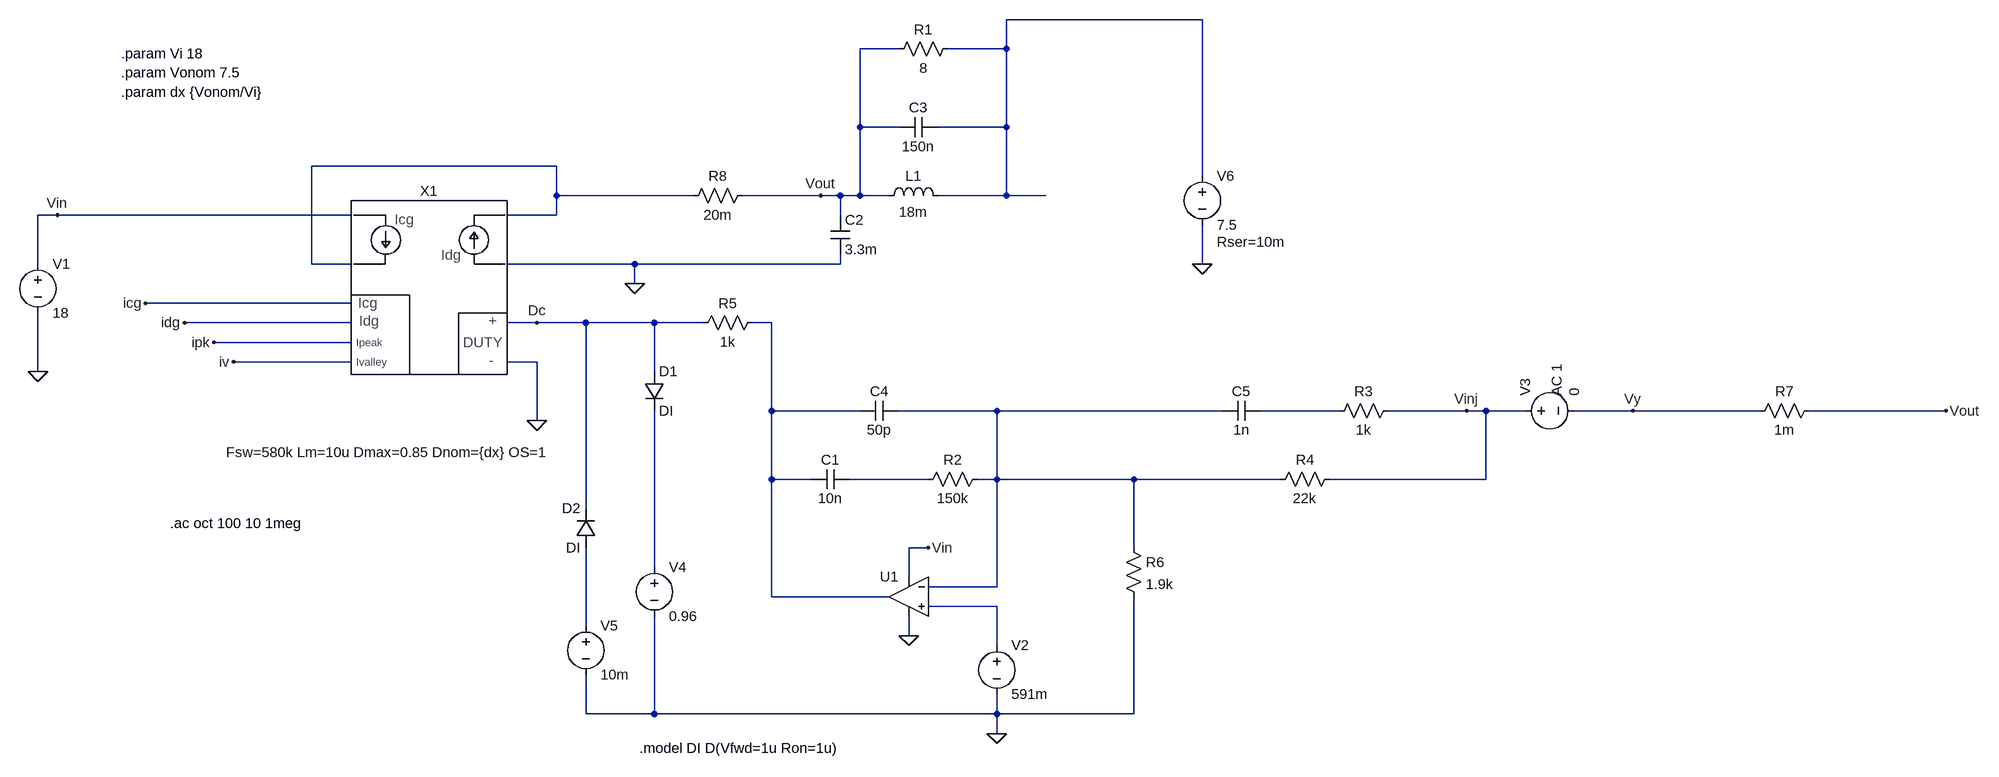
[diagram p0: schematic TPS40195_Reference_AC.asc]
TPS40195_Reference_AC.asc, the LTspice schematic file:
Version 4
SHEET 1 2744 952
WIRE 1456 -256 1136 -256
WIRE 960 -208 896 -208
WIRE 1136 -208 1136 -256
WIRE 1136 -208 1040 -208
WIRE 896 -80 896 -208
WIRE 960 -80 896 -80
WIRE 1136 -80 1136 -208
WIRE 1136 -80 1024 -80
WIRE 400 -16 0 -16
WIRE 1456 0 1456 -256
WIRE 400 32 400 -16
WIRE 624 32 400 32
WIRE 832 32 704 32
WIRE 864 32 832 32
WIRE 896 32 896 -80
WIRE 896 32 864 32
WIRE 944 32 896 32
WIRE 1136 32 1136 -80
WIRE 1136 32 1024 32
WIRE 1200 32 1136 32
WIRE -416 64 -448 64
WIRE 64 64 -416 64
WIRE 400 64 400 32
WIRE 400 64 320 64
WIRE 864 64 864 32
WIRE -448 144 -448 64
WIRE 0 144 0 -16
WIRE 64 144 0 144
WIRE 528 144 320 144
WIRE 864 144 864 128
WIRE 864 144 528 144
WIRE 1456 144 1456 80
WIRE 528 176 528 144
WIRE 64 208 -272 208
WIRE 64 240 -208 240
WIRE 368 240 320 240
WIRE 448 240 368 240
WIRE 560 240 448 240
WIRE 640 240 560 240
WIRE 752 240 720 240
WIRE 64 272 -160 272
WIRE 64 304 -128 304
WIRE 368 304 320 304
WIRE -448 320 -448 224
WIRE 560 320 560 240
WIRE 752 384 752 240
WIRE 896 384 752 384
WIRE 1120 384 960 384
WIRE 1488 384 1120 384
WIRE 1680 384 1552 384
WIRE 1888 384 1760 384
WIRE 1920 384 1888 384
WIRE 1984 384 1920 384
WIRE 2160 384 2064 384
WIRE 2368 384 2160 384
WIRE 2672 384 2448 384
WIRE 368 400 368 304
WIRE 752 496 752 384
WIRE 816 496 752 496
WIRE 1008 496 880 496
WIRE 1120 496 1120 384
WIRE 1120 496 1088 496
WIRE 1344 496 1120 496
WIRE 1584 496 1344 496
WIRE 1920 496 1920 384
WIRE 1920 496 1664 496
WIRE 448 544 448 240
WIRE 1008 608 976 608
WIRE 1344 608 1344 496
WIRE 560 640 560 384
WIRE 976 656 976 608
WIRE 1120 672 1120 496
WIRE 1120 672 1008 672
WIRE 752 688 752 496
WIRE 944 688 752 688
WIRE 1120 704 1008 704
WIRE 448 736 448 608
WIRE 976 752 976 720
WIRE 1120 768 1120 704
WIRE 448 880 448 816
WIRE 560 880 560 720
WIRE 560 880 448 880
WIRE 1120 880 1120 848
WIRE 1120 880 560 880
WIRE 1344 880 1344 688
WIRE 1344 880 1120 880
WIRE 1120 912 1120 880
FLAG 528 176 0
FLAG -448 320 0
FLAG 832 32 Vout
FLAG -416 64 Vin
FLAG 368 240 Dc
FLAG -272 208 icg
FLAG -208 240 idg
FLAG -160 272 ipk
FLAG -128 304 iv
FLAG 368 400 0
FLAG 976 752 0
FLAG 1008 608 Vin
FLAG 1120 912 0
FLAG 2672 384 Vout
FLAG 1888 384 Vinj
FLAG 1456 144 0
FLAG 2160 384 Vy
DATAFLAG -208 208 ""
DATAFLAG -112 240 ""
DATAFLAG -112 272 ""
DATAFLAG -32 304 ""
DATAFLAG 464 32 ""
DATAFLAG 1200 32 ""
DATAFLAG 480 240 ""
DATAFLAG 1200 384 ""
DATAFLAG 784 384 ""
SYMBOL voltage -448 128 R0
WINDOW 123 0 0 Left 0
WINDOW 39 0 0 Left 0
SYMATTR InstName V1
SYMATTR Value 18
SYMBOL Duty_Control_IRM 192 144 R0
WINDOW 39 -332 308 Left 2
SYMATTR SpiceLine Fsw=580k Lm=10u Dmax=0.85 Dnom={dx} OS=1
SYMATTR InstName X1
SYMBOL ind 928 48 R270
WINDOW 0 32 56 VTop 2
WINDOW 3 5 56 VBottom 2
SYMATTR InstName L1
SYMATTR Value 18m
SYMATTR SpiceLine Rser=6
SYMBOL cap 848 64 R0
SYMATTR InstName C2
SYMATTR Value 3.3m
SYMATTR SpiceLine Rser=10m
SYMBOL cap 1024 -96 R90
WINDOW 0 0 32 VBottom 2
WINDOW 3 32 32 VTop 2
SYMATTR InstName C3
SYMATTR Value 150n
SYMBOL res 1056 -224 R90
WINDOW 0 0 56 VBottom 2
WINDOW 3 32 56 VTop 2
SYMATTR InstName R1
SYMATTR Value 8
SYMBOL Opamps\\UniversalOpamp2 976 688 M0
SYMATTR InstName U1
SYMATTR Value2 Avol=1k GBW=7Meg Slew=10Meg
SYMATTR SpiceLine ilimit=25m rail=0 Vos=0 phimargin=68
SYMBOL voltage 1120 752 R0
WINDOW 123 0 0 Left 0
WINDOW 39 0 0 Left 0
SYMATTR InstName V2
SYMATTR Value 591m
SYMBOL cap 880 480 R90
WINDOW 0 0 32 VBottom 2
WINDOW 3 32 32 VTop 2
SYMATTR InstName C1
SYMATTR Value 10n
SYMBOL res 1104 480 R90
WINDOW 0 0 56 VBottom 2
WINDOW 3 32 56 VTop 2
SYMATTR InstName R2
SYMATTR Value 150k
SYMBOL cap 960 368 R90
WINDOW 0 0 32 VBottom 2
WINDOW 3 32 32 VTop 2
SYMATTR InstName C4
SYMATTR Value 50p
SYMBOL cap 1552 368 R90
WINDOW 0 0 32 VBottom 2
WINDOW 3 32 32 VTop 2
SYMATTR InstName C5
SYMATTR Value 1n
SYMBOL res 1776 368 R90
WINDOW 0 0 56 VBottom 2
WINDOW 3 32 56 VTop 2
SYMATTR InstName R3
SYMATTR Value 1k
SYMBOL res 1680 480 R90
WINDOW 0 0 56 VBottom 2
WINDOW 3 32 56 VTop 2
SYMATTR InstName R4
SYMATTR Value 22k
SYMBOL res 736 224 R90
WINDOW 0 0 56 VBottom 2
WINDOW 3 32 56 VTop 2
SYMATTR InstName R5
SYMATTR Value 1k
SYMBOL res 1328 592 R0
SYMATTR InstName R6
SYMATTR Value 1.9k
SYMBOL voltage 1968 384 R270
WINDOW 123 24 68 Left 2
WINDOW 39 0 0 Left 0
SYMATTR Value2 AC 1
SYMATTR InstName V3
SYMATTR Value 0
SYMBOL diode 544 320 R0
SYMATTR InstName D1
SYMATTR Value DI
SYMBOL voltage 560 624 R0
WINDOW 123 0 0 Left 0
WINDOW 39 0 0 Left 0
SYMATTR InstName V4
SYMATTR Value 0.96
SYMBOL diode 464 608 R180
WINDOW 0 24 64 Left 2
WINDOW 3 24 0 Left 2
SYMATTR InstName D2
SYMATTR Value DI
SYMBOL voltage 448 720 R0
WINDOW 123 0 0 Left 0
WINDOW 39 0 0 Left 0
SYMATTR InstName V5
SYMATTR Value 10m
SYMBOL voltage 1456 -16 R0
WINDOW 123 0 0 Left 0
WINDOW 39 24 124 Left 2
SYMATTR SpiceLine Rser=10m
SYMATTR InstName V6
SYMATTR Value 7.5
SYMBOL res 2464 368 R90
WINDOW 0 0 56 VBottom 2
WINDOW 3 32 56 VTop 2
SYMATTR InstName R7
SYMATTR Value 1m
SYMBOL res 720 16 R90
WINDOW 0 0 56 VBottom 2
WINDOW 3 32 56 VTop 2
SYMATTR InstName R8
SYMATTR Value 20m
TEXT -232 568 Left 2 !.ac oct 100 10 1meg
TEXT -312 -200 Left 2 !.param Vi 18\n.param Vonom 7.5\n.param dx {Vonom/Vi}
TEXT 536 936 Left 2 !.model DI D(Vfwd=1u Ron=1u)

The netlist it stands for:
* TPS40195_Reference_AC.asc
V1 Vin 0 18
XX1 Dc 0 Vin N002 N002 0 icg idg ipk iv Duty_Control_IRM params: Fsw=580k Lm=10u Dmax=0.85 Dnom={dx} OS=1  ; pins D+ D- Vcg+ Vcg- Vdg+ Vdg- Icharge Idischarge Ipeak Ivalley
L1 Vout N001 18m Rser=6
C2 Vout 0 3.3m Rser=10m
C3 N001 Vout 150n
R1 N001 Vout 8
XU1 N008 N004 Vin 0 N003 level.2 Avol=1k GBW=7Meg Slew=10Meg ilimit=25m rail=0 Vos=0 phimargin=68 en=0 enk=0 in=0 ink=0 Rin=500Meg  ; pins IN+ IN- V+ V- OUT
V2 N008 0 591m
C1 N006 N003 10n
R2 N004 N006 150k
C4 N004 N003 50p
C5 N005 N004 1n
R3 Vinj N005 1k
R4 Vinj N004 22k
R5 N003 Dc 1k
R6 N004 0 1.9k
V3 Vinj Vy 0 AC 1
D1 Dc N007 DI
V4 N007 0 0.96
D2 N009 Dc DI
V5 N009 0 10m
V6 N001 0 7.5 Rser=10m
R7 Vout Vy 1m
R8 Vout N002 20m
.model D D
.lib standard.dio
.ac oct 100 10 1meg
.param Vi 18
.param Vonom 7.5
.param dx {Vonom/Vi}
.model DI D(Vfwd=1u Ron=1u)
.lib UniversalOpamps2.sub
.backanno
.end